# Altium project MOD-ADC-10.PrjPCB (part 2 of 2)

## Sheet ADC_CH.SchDoc
size A4
Used 4 times, as channels U_ADC_CH0, U_ADC_CH1, U_ADC_CH2, U_ADC_CH3. Parts and nets are listed once, with the designators drawn on the sheet.
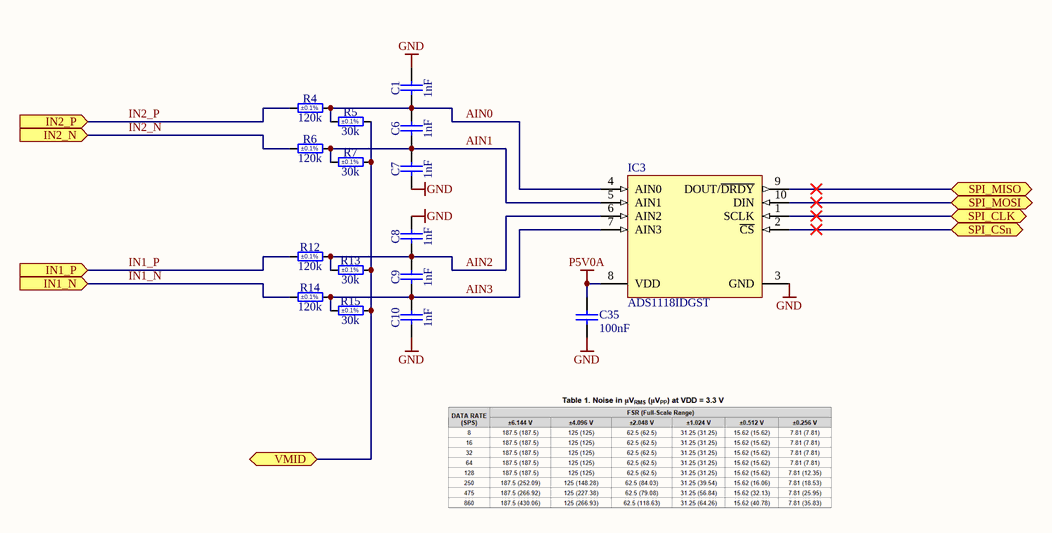
[diagram p3: ADC_CH.SchDoc]

### Parts
C1  1nF  [CAPC1608X90N]
C6  1nF  [CAPC1608X90N]
C7  1nF  [CAPC1608X90N]
C8  1nF  [CAPC1608X90N]
C9  1nF  [CAPC1608X90N]
C10  1nF  [CAPC1608X90N]
C35  100nF  [CAPC1005X55N]
IC3  ADS1118IDGST  [SOP50P490X110-10N]
R4  120k  Tolerance: ±0.1%  [RESC3216X65N]
R5  30k  Tolerance: ±0.1%  [RESC1608X55N]
R6  120k  Tolerance: ±0.1%  [RESC3216X65N]
R7  30k  Tolerance: ±0.1%  [RESC1608X55N]
R12  120k  Tolerance: ±0.1%  [RESC3216X65N]
R13  30k  Tolerance: ±0.1%  [RESC1608X55N]
R14  120k  Tolerance: ±0.1%  [RESC3216X65N]
R15  30k  Tolerance: ±0.1%  [RESC1608X55N]

### Ports
IN1_N (in), IN1_P (in), IN2_N (in), IN2_P (in), SPI_CLK (bidir), SPI_CSn (bidir), SPI_MISO (bidir), SPI_MOSI (bidir), VMID (bidir)

### Nets
GND: C1.2 C7.1 C8.2 C10.1 C35.1 IC3.3(GND)
P5V0A: C35.2 IC3.8(VDD)
AIN0: C1.1 C6.2 IC3.4(AIN0) R4.2 R5.1
AIN1: C6.1 C7.2 IC3.5(AIN1) R6.2 R7.1
AIN2: C8.1 C9.2 IC3.6(AIN2) R12.2 R13.1
AIN3: C9.1 C10.2 IC3.7(AIN3) R14.2 R15.1
IN1_N: R14.1 ; port IN1_N
IN1_P: R12.1 ; port IN1_P
IN2_N: R6.1 ; port IN2_N
IN2_P: R4.1 ; port IN2_P
SPI_CLK: IC3.1(SCLK) ; port SPI_CLK
SPI_CSn: IC3.2(~{CS}) ; port SPI_CSn
SPI_MISO: IC3.9(DOUT/~{DRDY}) ; port SPI_MISO
SPI_MOSI: IC3.10(DIN) ; port SPI_MOSI
VMID: R5.2 R7.2 R13.2 R15.2 ; port VMID

### Channels
U_ADC_CH0: designators end in A; ports IN1_N=IN1_N IN1_P=CH0 IN2_N=IN2_N IN2_P=CH1 SPI_CLK=SPI_5V_CLK SPI_CSn=SPI_5V_CSn0 SPI_MISO=SPI_5V_MISO0 SPI_MOSI=SPI_5V_MOSI VMID=VMID_A
U_ADC_CH1: designators end in B; ports IN1_N=IN1_N IN1_P=CH2 IN2_N=IN2_N IN2_P=CH3 SPI_CLK=SPI_5V_CLK SPI_CSn=SPI_5V_CSn1 SPI_MISO=SPI_5V_MISO1 SPI_MOSI=SPI_5V_MOSI VMID=VMID_A
U_ADC_CH2: designators end in C; ports IN1_N=IN1_N IN1_P=CH4 IN2_N=IN2_N IN2_P=CH5 SPI_CLK=SPI_5V_CLK SPI_CSn=SPI_5V_CSn2 SPI_MISO=SPI_5V_MISO2 SPI_MOSI=SPI_5V_MOSI VMID=VMID_B
U_ADC_CH3: designators end in D; ports IN1_N=IN1_N IN1_P=CH6 IN2_N=IN2_N IN2_P=CH7 SPI_CLK=SPI_5V_CLK SPI_CSn=SPI_5V_CSn3 SPI_MISO=SPI_5V_MISO3 SPI_MOSI=SPI_5V_MOSI VMID=VMID_B

### Library data of the parts
C1 C6-C10 = CC0603_1NF_50V_5%_NP0: Non-polarised capacitor; Part Description: SMD Multilayer Chip Ceramic Capacitor; Manufacturer: GENERIC; Manufacturer1 Part Number: CC0603JRNPO9BN102; Voltage: 50V; TC: C0G/NP0; Tolerance: ±5%; Part Number: CC0603_1NF_50V_5%_NP0; Component Kind: Standard; Component Type: Standard; Pin Count: 2; Value: 1nF; Status: Preferred; Manufacturer Part Number: CC0603_1NF_50V_5%_NP0; Case: 0603; Mounted: Yes; Socket: No; SMD: Yes; Sense: No; Manufacturer1 Example: YAGEO PHYCOMP; Manufacturer1 ComponentHeight: 0.9mm; HelpURL: \\cern.ch\dfs\Applications\Altium\Datasheets\CC0805_NP0_PHYCOMP_16VTO50V.pdf; Author: CERN DEM JLC; CreateDate: 22.10.2012; LatestRevisionDate: 22.10.2012
C35 = CC0402_100NF_16V_10%_X7R: Non-polarised capacitor; Part Description: SMD Multilayer Chip Ceramic Capacitor; Manufacturer: GENERIC; Manufacturer1 Part Number: GRM155R71C104KA88D; Voltage: 16V; TC: X7R; Tolerance: ±10%; Part Number: CC0402_100NF_16V_10%_X7R; Component Kind: Standard; Component Type: Standard; Pin Count: 2; Value: 100nF; Status: Not Recommended; Manufacturer Part Number: CC0402_100NF_16V_10%_X7R; Case: 0402; Mounted: Yes; Socket: No; SMD: Yes; Sense: No; Manufacturer1 Example: MURATA; Manufacturer1 ComponentHeight: 0.55mm; HelpURL: \\cern.ch\dfs\Applications\Altium\Datasheets\CC0402_X7R_MURATA_GRM.pdf; Author: CERN DEM JLC; CreateDate: 12/5/2013; LatestRevisionDate: 12/3/2007
IC3 = ADS1118IDGST: Quad Channel Single ADC Delta-Sigma 860sps 16-bit Serial 10-Pin VSSOP T/R; Manufacturer: Texas Instruments; Min Supply Voltage: 2V; Max Supply Voltage: 5.5V; Number of Channels: 2; Max Power Dissipation: 900uW; Operating Supply Voltage: 3.3V; Interface: SPI; Number of Bits: 16; Number of Converters: 1; Resolution: 16b; Sampling Rate: 860S/s; Polarity: Bipolar; Integral Nonlinearity (INL): 1LSB; Number of Inputs: 4; Supply Current: 150uA; Supplier: Mouser; Supplier Part Number: 595-ADS1118IDGST; Manufacturer Part Number: ADS1118IDGST; RoHS: Yes; Category: Analog to Digital Converters (ADCs); Stock: 2422; Pricing: 1=6.29, 10=4.83, 25=4.47, 50=4.47, 100=4.07, 250=3.87, 500=3.69, 1000=3.59, 2500=3.5, 10000=3.59 (USD); Case/Package: VSSOP; Pins: 10; Contact Plating: Gold; Min Operating Temperature: -40°C; Max Operating Temperature: 125°C; Package Quantity: 250; Packaging: Tape and Reel; Number of A/D Converters: 1; Number of Elements: 1; Supply Type: Single; Conversion Rate: 860S/s; Max Supply Voltage (DC): 5.5V; Min Supply Voltage (DC): 2V; Power Dissipation: 900uW; Series: -; Length: 3.1mm; Width: 3.1mm; Height: 1.1mm; Thickness: 1.02mm; Reach SVHC Compliant: No; Lead Free: Lead Free; RoHS Compliant: Yes; ComponentLink1URL: https://datasheet.ciiva.com/7989/1634024-7989312.pdf?src-supplier=Element14; ComponentLink1Description: https://datasheet.ciiva.com/7989/1634024-7989312.pdf?src-supplier=Element14; ComponentLink2URL: https://datasheet.ciiva.com/41461/001186694-da-01-en-ic-adc-16bit-sp-ads1118idgst-msop-10-tid-41461012.pdf?src-supplier=Conrad; ComponentLink2Description: https://datasheet.ciiva.com/41461/001186694-da-01-en-ic-adc-16bit-sp-ads1118idgst-msop-10-tid-41461012.pdf?src-supplier=Conrad; ComponentLink3URL: https://datasheet.ciiva.com/1261/ads1118-1261457.pdf?src-supplier=Digikey; ComponentLink3Description: https://datasheet.ciiva.com/1261/ads1118-1261457.pdf?src-supplier=Digikey; ComponentLink4URL: https://datasheet.ciiva.com/1261/ads1118-1261458.pdf?src-supplier=Digikey; ComponentLink4Description: https://datasheet.ciiva.com/1261/ads1118-1261458.pdf?src-supplier=Digikey; ComponentLink5URL: https://datasheet.ciiva.com/1261/ads1118-1261459.pdf?src-supplier=Digikey; ComponentLink5Description: https://datasheet.ciiva.com/1261/ads1118-1261459.pdf?src-supplier=Digikey; ComponentLink6URL: https://datasheet.ciiva.com/14259/ads1118-14259989.pdf?src-supplier=Avnet; ComponentLink6Description: https://datasheet.ciiva.com/14259/ads1118-14259989.pdf?src-supplier=Avnet; ComponentLink7URL: https://datasheet.ciiva.com/46394/1793017-46394506.pdf?src-supplier=Element14; ComponentLink7Description: https://datasheet.ciiva.com/46394/1793017-46394506.pdf?src-supplier=Element14; ComponentLink8URL: https://datasheet.ciiva.com/46394/1793017-46394507.pdf?src-supplier=Element14; ComponentLink8Description: https://datasheet.ciiva.com/46394/1793017-46394507.pdf?src-supplier=Element14
R4 R6 R12 R14 = R1206_120K_0.1%_0.25W_25PPM: Resistor - 0.1%; Part Description: Thin Film Chip Resistor; Manufacturer: GENERIC; Manufacturer1 Part Number: RN73H2BTTD1203B25; Power: 0.25W; TC: ±25ppm/°C; PressFit: No; Part Number: R1206_120K_0.1%_0.25W_25PPM; Component Kind: Standard; Component Type: Standard; Pin Count: 2; Value: 120k; Status: Not Recommended; Manufacturer Part Number: R1206_120K_0.1%_0.25W_25PPM; Case: 1206; Mounted: Yes; Sense: No; Socket: No; SMD: Yes; Manufacturer1 Example: KOA; Manufacturer1 ComponentHeight: 0.70mm; HelpURL: \\cern.ch\dfs\Applications\Altium\Datasheets\R1206_KOA_RN73H.pdf; Author: CERN DEM JLC; CreateDate: 03.12.2007; LatestRevisionDate: 13.03.2008
R5 R7 R13 R15 = R0603_30K_0.1%_0.063W_25PPM: Resistor - 0.1%; Part Description: Thin Film Precision Resistor; Manufacturer: GENERIC; Manufacturer1 Part Number: CPF0603B30KE; Power: 0.063W; TC: ±25ppm/°C; PressFit: No; Part Number: R0603_30K_0.1%_0.063W_25PPM; Component Kind: Standard; Component Type: Standard; Pin Count: 2; Value: 30k; Status: Not Recommended; Manufacturer Part Number: R0603_30K_0.1%_0.063W_25PPM; Case: 0603; Mounted: Yes; Sense: No; Socket: No; SMD: Yes; Manufacturer1 Example: TE CONNECTIVITY; Manufacturer1 ComponentHeight: 0.55mm; HelpURL: \\cern.ch\dfs\Applications\Altium\Datasheets\R0603_TYCO_CPF.pdf; Author: CERN DEM JMW; CreateDate: 28.07.2021; LatestRevisionDate: 28.07.2021

## Nets that join several sheets
GND: MOD-ADC-10 (52 pins), SPI_IFC (14 pins), CPLD (45 pins), U_ADC_CH0 (6 pins), U_ADC_CH1 (6 pins), U_ADC_CH2 (6 pins), U_ADC_CH3 (6 pins)
P3V3MP: MOD-ADC-10 (9 pins), SPI_IFC (J1.B18), CPLD (34 pins)
P5V0A: MOD-ADC-10 (10 pins), U_ADC_CH0 (C35A.2 IC3A.8), U_ADC_CH1 (C35B.2 IC3B.8), U_ADC_CH2 (C35C.2 IC3C.8), U_ADC_CH3 (C35D.2 IC3D.8)
P12V0: MOD-ADC-10 (L1.1), SPI_IFC (J1.A2 J1.A3)
CH0: MOD-ADC-10 (J3.1), U_ADC_CH0 (R12A.1)
CH1: MOD-ADC-10 (J4.1), U_ADC_CH0 (R4A.1)
CH2: MOD-ADC-10 (J2.1), U_ADC_CH1 (R12B.1)
CH3: MOD-ADC-10 (J5.1), U_ADC_CH1 (R4B.1)
CH4: MOD-ADC-10 (J8.1), U_ADC_CH2 (R12C.1)
CH5: MOD-ADC-10 (J10.1), U_ADC_CH2 (R4C.1)
CH6: MOD-ADC-10 (J9.1), U_ADC_CH3 (R12D.1)
CH7: MOD-ADC-10 (J7.1), U_ADC_CH3 (R4D.1)
ERRIN0: MOD-ADC-10 (R25.1 R26.2), CPLD (IC2.63 IC15.14)
ERRIN1: MOD-ADC-10 (R28.1 R29.2), CPLD (IC2.64 IC15.13)
FAULTn: SPI_IFC (J1.B7), CPLD (IC2.19)
GA0: SPI_IFC (J1.B1), CPLD (IC2.27 IC15.19 R8.2)
GA1: SPI_IFC (J1.B2), CPLD (IC2.21 IC10.6 IC15.20 R9.2)
GA2: SPI_IFC (J1.B3), CPLD (IC2.24 IC10.5 IC15.1 R10.2)
GA3: SPI_IFC (J1.B4), CPLD (IC2.25 IC15.10 R11.2)
HSPI_AD0: SPI_IFC (J1.B8), CPLD (IC2.18)
HSPI_AD1: SPI_IFC (J1.B9), CPLD (IC2.17)
HSPI_AD2: SPI_IFC (J1.B10), CPLD (IC2.16)
HSPI_AD3: SPI_IFC (J1.B11), CPLD (IC2.15)
HSPI_CLK: SPI_IFC (J1.A5), CPLD (IC2.12)
HSPI_CSn: SPI_IFC (J1.A8), CPLD (IC2.9)
HSPI_ID: SPI_IFC (J1.A6), CPLD (IC2.10)
HSPI_Q: SPI_IFC (J1.A9), CPLD (IC2.8)
HSPI_sAD0: SPI_IFC (J1.A12), CPLD (IC2.4)
HSPI_sAD1: SPI_IFC (J1.A11), CPLD (IC2.7)
IN1_N: MOD-ADC-10 (J3.2 J3.3 J3.4 J3.5), U_ADC_CH0 (R14A.1)
IN1_N: MOD-ADC-10 (J2.2 J2.3 J2.4 J2.5), U_ADC_CH1 (R14B.1)
IN1_N: MOD-ADC-10 (J8.2 J8.3 J8.4 J8.5), U_ADC_CH2 (R14C.1)
IN1_N: MOD-ADC-10 (J9.2 J9.3 J9.4 J9.5), U_ADC_CH3 (R14D.1)
IN2_N: MOD-ADC-10 (J4.2 J4.3 J4.4 J4.5), U_ADC_CH0 (R6A.1)
IN2_N: MOD-ADC-10 (J5.2 J5.3 J5.4 J5.5), U_ADC_CH1 (R6B.1)
IN2_N: MOD-ADC-10 (J10.2 J10.3 J10.4 J10.5), U_ADC_CH2 (R6C.1)
IN2_N: MOD-ADC-10 (J7.2 J7.3 J7.4 J7.5), U_ADC_CH3 (R6D.1)
Module_EN: SPI_IFC (J1.B14), CPLD (IC2.14 IC15.3)
NetIC2_30: MOD-ADC-10 (R22.1 R23.2), CPLD (IC2.30)
NetIC2_67: MOD-ADC-10 (R34.2 R48.1), CPLD (IC2.67)
NetIC2_68: MOD-ADC-10 (R47.1), CPLD (IC2.68)
NetJ1_B17: SPI_IFC (J1.B17), CPLD (5 pins)
RESETn: SPI_IFC (J1.B12), CPLD (IC2.81)
SCL: SPI_IFC (J1.B5), CPLD (IC2.13 IC10.2 IC15.16)
SDA: SPI_IFC (J1.B6), CPLD (IC2.20 IC10.1 IC15.17)
SPI_5V_CLK: MOD-ADC-10 (IC5.19), U_ADC_CH0 (IC3A.1), U_ADC_CH1 (IC3B.1), U_ADC_CH2 (IC3C.1), U_ADC_CH3 (IC3D.1)
SPI_5V_CSn0: MOD-ADC-10 (IC5.17), U_ADC_CH0 (IC3A.2)
SPI_5V_CSn1: MOD-ADC-10 (IC5.16), U_ADC_CH1 (IC3B.2)
SPI_5V_CSn2: MOD-ADC-10 (IC5.15), U_ADC_CH2 (IC3C.2)
SPI_5V_CSn3: MOD-ADC-10 (IC5.14), U_ADC_CH3 (IC3D.2)
SPI_5V_MISO0: MOD-ADC-10 (IC1.21), U_ADC_CH0 (IC3A.9)
SPI_5V_MISO1: MOD-ADC-10 (IC1.20), U_ADC_CH1 (IC3B.9)
SPI_5V_MISO2: MOD-ADC-10 (IC1.19), U_ADC_CH2 (IC3C.9)
SPI_5V_MISO3: MOD-ADC-10 (IC1.18), U_ADC_CH3 (IC3D.9)
SPI_5V_MOSI: MOD-ADC-10 (IC5.18), U_ADC_CH0 (IC3A.10), U_ADC_CH1 (IC3B.10), U_ADC_CH2 (IC3C.10), U_ADC_CH3 (IC3D.10)
SPI_CLK: MOD-ADC-10 (IC5.5), CPLD (IC2.36)
SPI_CSn0: MOD-ADC-10 (IC5.7), CPLD (IC2.38)
SPI_CSn1: MOD-ADC-10 (IC5.8), CPLD (IC2.39)
SPI_CSn2: MOD-ADC-10 (IC5.9), CPLD (IC2.40)
SPI_CSn3: MOD-ADC-10 (IC5.10), CPLD (IC2.41)
SPI_MISO0: MOD-ADC-10 (IC1.3), CPLD (IC2.31)
SPI_MISO1: MOD-ADC-10 (IC1.4), CPLD (IC2.32)
SPI_MISO2: MOD-ADC-10 (IC1.5), CPLD (IC2.34)
SPI_MISO3: MOD-ADC-10 (IC1.6), CPLD (IC2.35)
SPI_MOSI: MOD-ADC-10 (IC5.6), CPLD (IC2.37)
TCK: SPI_IFC (J1.B28), CPLD (IC2.91 J6.4 R1.1)
TDI: SPI_IFC (J1.A27), CPLD (IC2.94 J6.3 R80.1)
TDO: SPI_IFC (J1.B27), CPLD (IC2.95 J6.6)
TMS: SPI_IFC (J1.A28), CPLD (IC2.90 J6.2 R2.1)
VMID_A: MOD-ADC-10 (IC6.1 IC6.2), U_ADC_CH0 (R5A.2 R7A.2 R13A.2 R15A.2), U_ADC_CH1 (R5B.2 R7B.2 R13B.2 R15B.2)
VMID_B: MOD-ADC-10 (IC6.6 IC6.7), U_ADC_CH2 (R5C.2 R7C.2 R13C.2 R15C.2), U_ADC_CH3 (R5D.2 R7D.2 R13D.2 R15D.2)